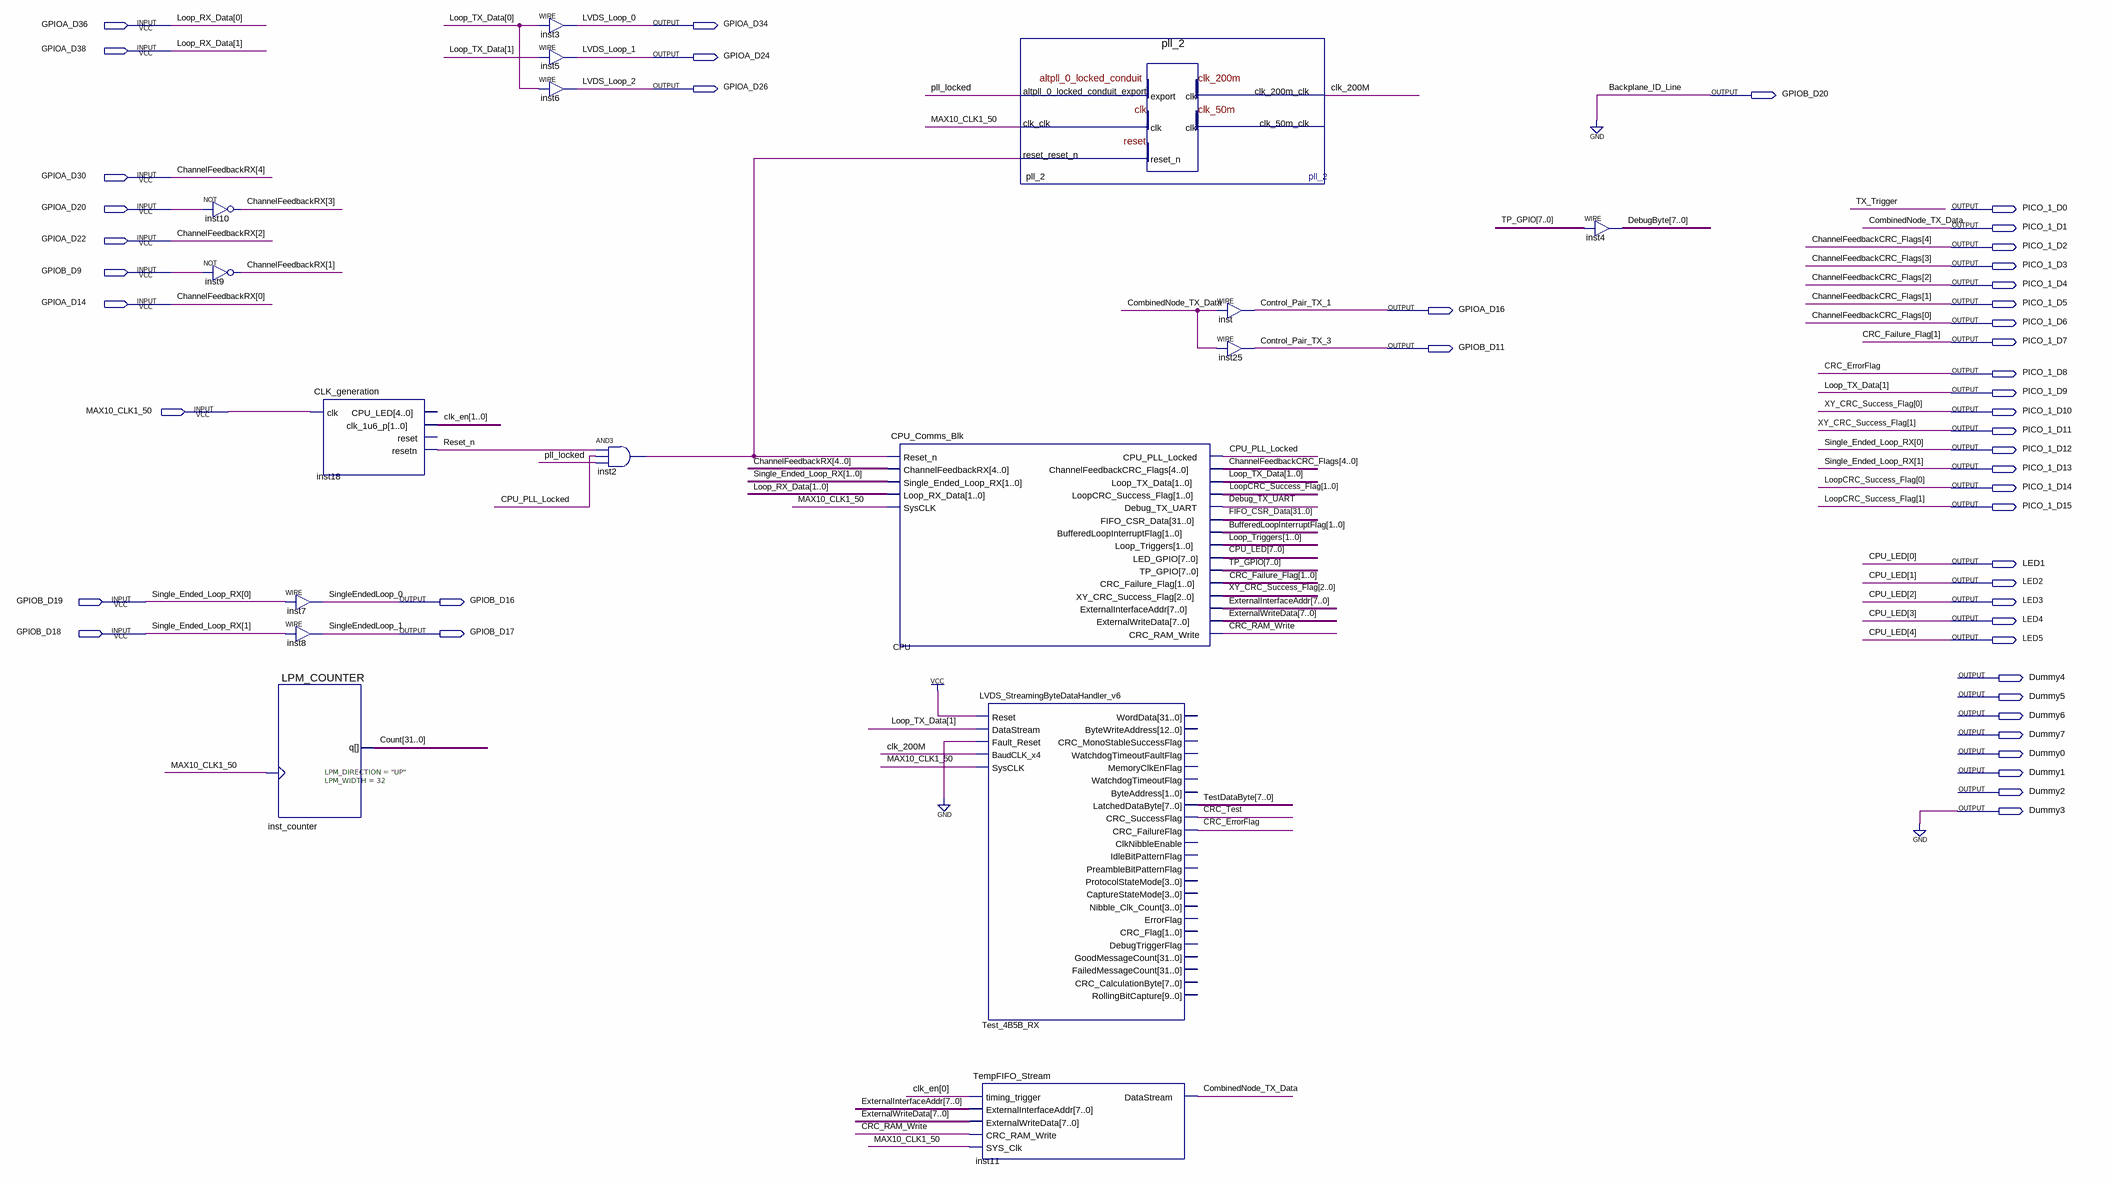
[diagram p0: schematic sheet]
// Quartus schematic ObserverFncs_TopLevel.bdf as structural Verilog: 17 symbols, 47 pins
module ObserverFncs_TopLevel (
  input  GPIOA_D36,
  input  GPIOA_D38,
  input  GPIOA_D30,
  input  GPIOA_D20,
  input  GPIOA_D22,
  input  GPIOB_D9,
  input  GPIOA_D14,
  input  MAX10_CLK1_50,
  input  GPIOB_D19,
  input  GPIOB_D18,
  output GPIOA_D34,
  output GPIOA_D24,
  output GPIOA_D26,
  output GPIOB_D20,
  output PICO_1_D0,
  output PICO_1_D1,
  output PICO_1_D2,
  output PICO_1_D3,
  output PICO_1_D4,
  output PICO_1_D5,
  output GPIOA_D16,
  output PICO_1_D6,
  output PICO_1_D7,
  output GPIOB_D11,
  output PICO_1_D8,
  output PICO_1_D9,
  output PICO_1_D10,
  output PICO_1_D11,
  output PICO_1_D12,
  output PICO_1_D13,
  output PICO_1_D14,
  output PICO_1_D15,
  output LED1,
  output LED2,
  output GPIOB_D16,
  output LED3,
  output LED4,
  output GPIOB_D17,
  output LED5,
  output Dummy4,
  output Dummy5,
  output Dummy6,
  output Dummy7,
  output Dummy0,
  output Dummy1,
  output Dummy2,
  output Dummy3
);

  wire clk_200M, CPU_PLL_Locked, CRC_RAM_Write, CRC_Test, Debug_TX_UART, inst2_out, pll_locked, Reset_n;
  wire [0:0] CRC_Failure_Flag, Loop_TX_Data;
  wire [1:0] BufferedLoopInterruptFlag, clk_en, Loop_Triggers;
  wire [2:2] XY_CRC_Success_Flag;
  wire [3:1] ChannelFeedbackRX;
  wire [7:0] DebugByte, ExternalInterfaceAddr, ExternalWriteData, TestDataByte, TP_GPIO;
  wire [7:5] CPU_LED;
  wire [31:0] Count, FIFO_CSR_Data;

  not inst10 (ChannelFeedbackRX[3], GPIOA_D20);
  not inst9 (ChannelFeedbackRX[1], GPIOB_D9);
  assign GPIOB_D16 = GPIOB_D19;  // WIRE inst7
  assign GPIOB_D17 = GPIOB_D18;  // WIRE inst8
  LPM_COUNTER #(.LPM_DIRECTION("UP"), .LPM_WIDTH(32)) inst_counter (.clock(MAX10_CLK1_50), .q(Count));
  CLK_generation inst18 (.clk(MAX10_CLK1_50), .clk_1u6_p(clk_en), .resetn(Reset_n));  // open: CPU_LED, reset
  assign GPIOA_D34 = Loop_TX_Data[0];  // WIRE inst3
  assign GPIOA_D24 = PICO_1_D9;  // WIRE inst5
  assign GPIOA_D26 = Loop_TX_Data[0];  // WIRE inst6
  and inst2 (inst2_out, Reset_n, CPU_PLL_Locked, pll_locked);
  CPU_Comms_Blk CPU (
    .Reset_n(inst2_out),
    .ChannelFeedbackRX({GPIOA_D30, ChannelFeedbackRX[3], GPIOA_D22, ChannelFeedbackRX[1], GPIOA_D14}),
    .Single_Ended_Loop_RX({GPIOB_D18, GPIOB_D19}), .Loop_RX_Data({GPIOA_D38, GPIOA_D36}),
    .SysCLK(MAX10_CLK1_50), .CPU_PLL_Locked(CPU_PLL_Locked),
    .ChannelFeedbackCRC_Flags({PICO_1_D2, PICO_1_D3, PICO_1_D4, PICO_1_D5, PICO_1_D6}),
    .Loop_TX_Data({PICO_1_D9, Loop_TX_Data[0]}), .LoopCRC_Success_Flag({PICO_1_D15, PICO_1_D14}),
    .Debug_TX_UART(Debug_TX_UART), .FIFO_CSR_Data(FIFO_CSR_Data),
    .BufferedLoopInterruptFlag(BufferedLoopInterruptFlag), .Loop_Triggers(Loop_Triggers),
    .LED_GPIO({CPU_LED, LED5, LED4, LED3, LED2, LED1}), .TP_GPIO(TP_GPIO),
    .CRC_Failure_Flag({PICO_1_D7, CRC_Failure_Flag[0]}),
    .XY_CRC_Success_Flag({XY_CRC_Success_Flag[2], PICO_1_D11, PICO_1_D10}),
    .ExternalInterfaceAddr(ExternalInterfaceAddr), .ExternalWriteData(ExternalWriteData),
    .CRC_RAM_Write(CRC_RAM_Write));
  LVDS_StreamingByteDataHandler_v6 Test_4B5B_RX (
    .Reset(1'b1), .DataStream(PICO_1_D9), .Fault_Reset(1'b0), .BaudCLK_x4(clk_200M), .SysCLK(MAX10_CLK1_50),
    .LatchedDataByte(TestDataByte), .CRC_SuccessFlag(CRC_Test), .CRC_FailureFlag(PICO_1_D8));  // open: WordData, ByteWriteAddress, CRC_MonoStableSuccessFlag, WatchdogTimeoutFaultFlag, MemoryClkEnFlag, WatchdogTimeoutFlag, ByteAddress, ClkNibbleEnable, IdleBitPatternFlag, PreambleBitPatternFlag, ProtocolStateMode, CaptureStateMode, Nibble_Clk_Count, ErrorFlag, CRC_Flag, DebugTriggerFlag, GoodMessageCount, FailedMessageCount, CRC_CalculationByte, RollingBitCapture
  TempFIFO_Stream inst11 (
    .timing_trigger(clk_en[0]), .ExternalInterfaceAddr(ExternalInterfaceAddr),
    .ExternalWriteData(ExternalWriteData), .CRC_RAM_Write(CRC_RAM_Write), .SYS_Clk(MAX10_CLK1_50),
    .DataStream(PICO_1_D1));
  pll_2 pll_2 (
    .clk_clk(MAX10_CLK1_50), .reset_reset_n(inst2_out), .altpll_0_locked_conduit_export(pll_locked),
    .clk_200m_clk(clk_200M));  // open: clk_50m_clk
  assign GPIOA_D16 = PICO_1_D1;  // WIRE inst
  assign GPIOB_D11 = PICO_1_D1;  // WIRE inst25
  assign DebugByte = TP_GPIO;  // WIRE inst4

  assign Dummy3 = 1'b0;
  assign GPIOB_D20 = 1'b0;
  assign PICO_1_D12 = GPIOB_D19;
  assign PICO_1_D13 = GPIOB_D18;

  // Other names for the same wires on the sheet: ChannelFeedbackCRC_Flags[4:0] = {PICO_1_D2, PICO_1_D3, PICO_1_D4, PICO_1_D5, PICO_1_D6};
  //   ChannelFeedbackRX (some bits) = {GPIOA_D30, GPIOA_D22, GPIOA_D14}; CombinedNode_TX_Data = PICO_1_D1;
  //   Control_Pair_TX_1 = GPIOA_D16; Control_Pair_TX_3 = GPIOB_D11; CPU_LED[4:0] = {LED5, LED4, LED3, LED2, LED1};
  //   CRC_ErrorFlag = PICO_1_D8; CRC_Failure_Flag[1] = PICO_1_D7; Loop_RX_Data[1:0] = {GPIOA_D38, GPIOA_D36};
  //   Loop_TX_Data[1] = PICO_1_D9; LoopCRC_Success_Flag[1:0] = {PICO_1_D15, PICO_1_D14}; LVDS_Loop_0 = GPIOA_D34;
  //   LVDS_Loop_1 = GPIOA_D24; LVDS_Loop_2 = GPIOA_D26; Single_Ended_Loop_RX[1:0] = {GPIOB_D18, GPIOB_D19};
  //   SingleEndedLoop_0 = GPIOB_D16; SingleEndedLoop_1 = GPIOB_D17;
  //   XY_CRC_Success_Flag[1:0] = {PICO_1_D11, PICO_1_D10}
endmodule
